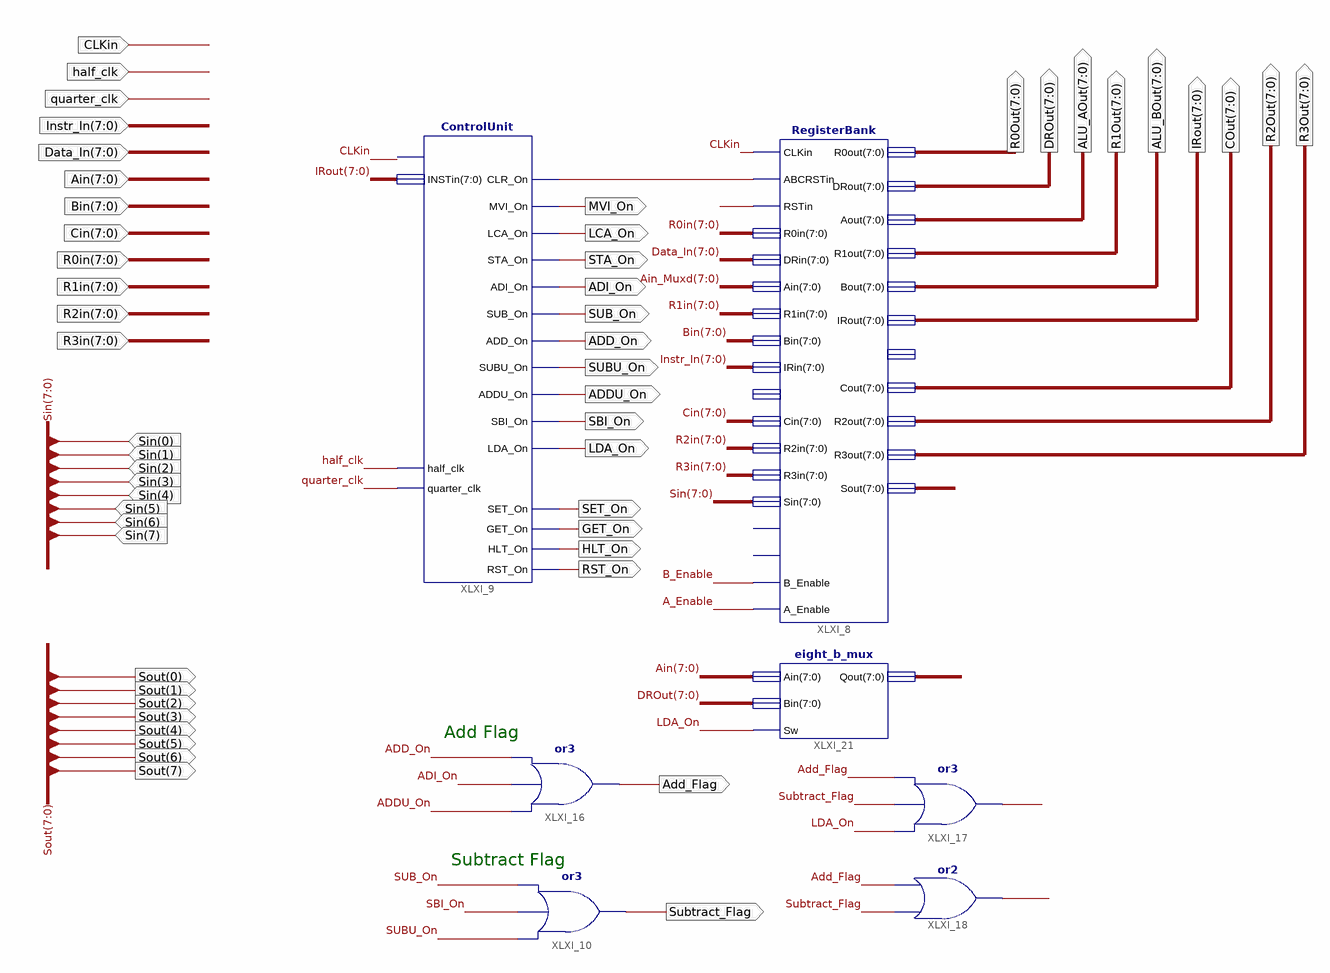
[diagram p0: schematic sheet 1]
// Xilinx ISE schematic MainControlUnit.sch (spartan3e) as structural Verilog: 7 symbols, 53 ports
module MainControlUnit (
  input  CLKin,
  input  [7:0] Instr_In,
  input  [7:0] Data_In,
  input  half_clk,
  input  quarter_clk,
  input  [7:0] Ain,
  input  [7:0] Bin,
  input  [7:0] Cin,
  input  [7:0] R0in,
  input  [7:0] R1in,
  input  [7:0] R2in,
  input  [7:0] R3in,
  input  [7:0] Sin,
  output MVI_On,
  output LCA_On,
  output STA_On,
  output ADI_On,
  output SUB_On,
  output ADD_On,
  output SUBU_On,
  output ADDU_On,
  output SBI_On,
  output LDA_On,
  output HLT_On,
  output SET_On,
  output GET_On,
  output [7:0] ALU_AOut,
  output [7:0] ALU_BOut,
  output [7:0] COut,
  output [7:0] IRout,
  output [7:0] DROut,
  output [7:0] R0Out,
  output [7:0] R2Out,
  output [7:0] R1Out,
  output [7:0] R3Out,
  output [7:0] Sout,
  output Subtract_Flag,
  output Add_Flag,
  output RST_On
);

  wire A_Enable, B_Enable, XLXN_6, XLXN_7;
  wire [7:0] Ain_Muxd;

  RegisterBank XLXI_8 (
    .ABCRSTin(XLXN_6), .RSTin(XLXN_7), .DRin(Data_In), .Ain(Ain_Muxd), .Bin(Bin), .IRin(Instr_In), .Cin(Cin),
    .Sin(Sin), .R0in(R0in), .R1in(R1in), .R2in(R2in), .R3in(R3in), .CLKin(CLKin), .DRout(DROut),
    .Aout(ALU_AOut), .Bout(ALU_BOut), .IRout(IRout), .Cout(COut), .Sout(Sout), .R0out(R0Out), .R1out(R1Out),
    .R2out(R2Out), .R3out(R3Out), .B_Enable(B_Enable), .A_Enable(A_Enable));  // open: Zin, Zout, half_clk, quarter_clk
  or XLXI_10 (Subtract_Flag, SUBU_On, SBI_On, SUB_On);
  or XLXI_16 (Add_Flag, ADDU_On, ADI_On, ADD_On);
  ControlUnit XLXI_9 (
    .CLKin(CLKin), .INSTin(IRout), .half_clk(half_clk), .quarter_clk(quarter_clk), .CLR_On(XLXN_6),
    .MVI_On(MVI_On), .LCA_On(LCA_On), .STA_On(STA_On), .ADI_On(ADI_On), .SUB_On(SUB_On), .ADD_On(ADD_On),
    .SUBU_On(SUBU_On), .ADDU_On(ADDU_On), .SBI_On(SBI_On), .LDA_On(LDA_On), .SET_On(SET_On), .GET_On(GET_On),
    .HLT_On(HLT_On), .RST_On(RST_On));
  or XLXI_17 (A_Enable, LDA_On, Subtract_Flag, Add_Flag);
  or XLXI_18 (B_Enable, Subtract_Flag, Add_Flag);
  eight_b_mux XLXI_21 (.Ain(Ain), .Bin(DROut), .Sw(LDA_On), .Qout(Ain_Muxd));

  // Notes on the sheet:
  //   Add Flag
  //   Subtract Flag
endmodule
